# Altium schematic sheet CDRon_IMU.SchDoc
size A4
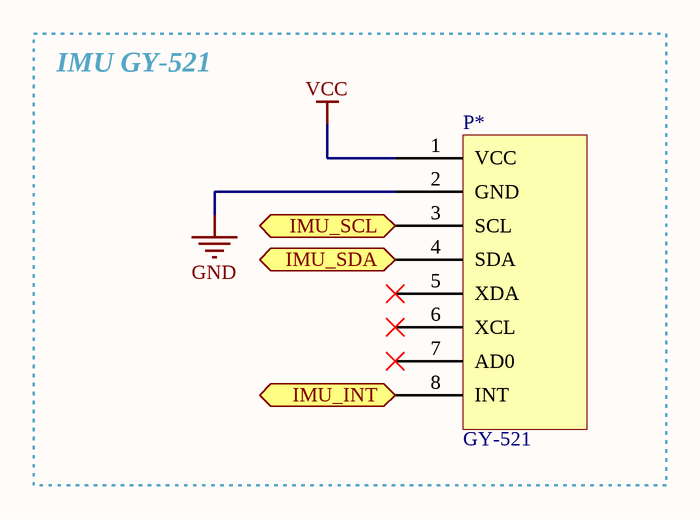
[diagram p0: CDRon_IMU.SchDoc]

## Parts
P*  GY-521  [GY-521]

## Blocks framed on the sheet
IMU GY-521: P*

## Ports
IMU_INT (in), IMU_SCL (in), IMU_SDA (in)

## Nets
GND: P*.2(GND)
VCC: P*.1(VCC)
IMU_INT: P*.8(INT) ; port IMU_INT
IMU_SCL: P*.3(SCL) ; port IMU_SCL
IMU_SDA: P*.4(SDA) ; port IMU_SDA

Not connected (* = marked no-connect by the designer): P* 5(XDA)* 6(XCL)* 7(AD0)*